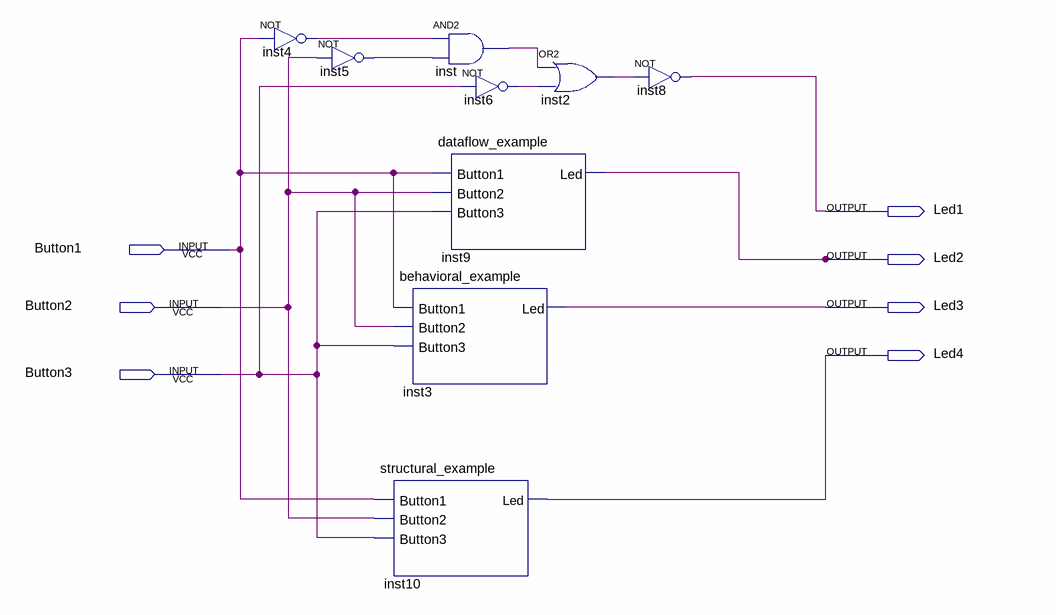
[diagram p0: schematic sheet]
// Quartus schematic diagram_example.bdf as structural Verilog: 9 symbols, 7 pins
module diagram_example (
  input  Button1,
  input  Button2,
  input  Button3,
  output Led1,
  output Led2,
  output Led3,
  output Led4
);

  wire inst2_out, inst4_out, inst5_out, inst6_out, inst_out;

  not inst4 (inst4_out, Button1);
  not inst5 (inst5_out, Button2);
  and inst (inst_out, inst4_out, inst5_out);
  dataflow_example inst9 (.Button1(Button1), .Button2(Button2), .Button3(Button3), .Led(Led2));
  behavioral_example inst3 (.Button1(Button1), .Button2(Button2), .Button3(Button3), .Led(Led3));
  structural_example inst10 (.Button1(Button1), .Button2(Button2), .Button3(Button3), .Led(Led4));
  not inst6 (inst6_out, Button3);
  or inst2 (inst2_out, inst_out, inst6_out);
  not inst8 (Led1, inst2_out);
endmodule
